# Altium project ADAS_ECU_revA.PrjPcb (part 6 of 6)
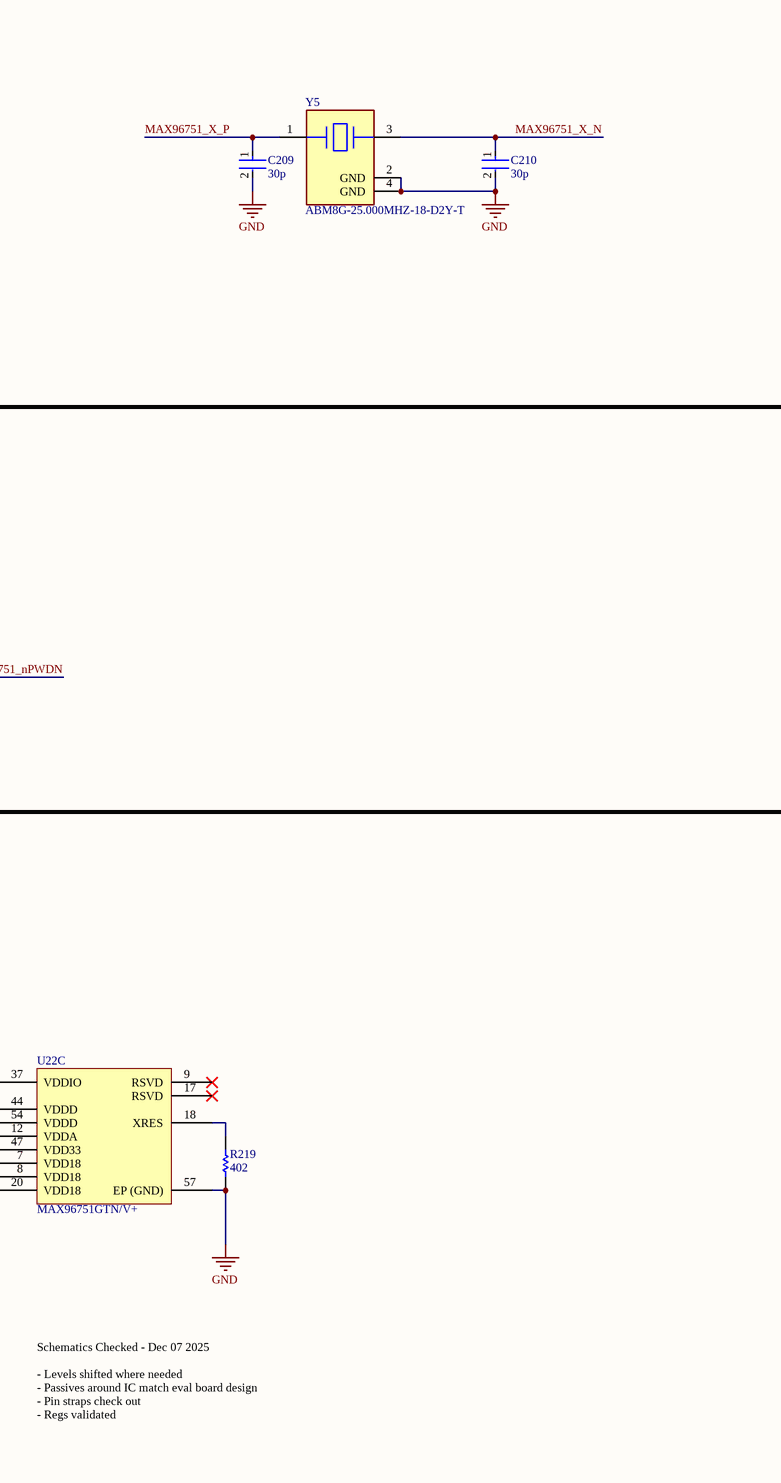
[diagram p45: MAX96751_PINOUT.SchDoc, bottom right]

## Nets that join several sheets
3V3_HDMI: ADAS_ECU_revA (F19.2), DP_TO_HDMI (U28.5)
3V3_INT: ADAS_ECU_revA (5 pins), JETSON_V2 (R232.2 R234.2 R238.2 R240.2), STM32G473RET6_PINOUT (19 pins), TCAN1146_PINOUT (C125.1 U9.5), OR_0 (R58_OR_0.2), OR_1 (R58_OR_1.2), PWR_PROT_0 (C74_PWR_PROT_0.1 R66_PWR_PROT_0.2 U7_PWR_PROT_0.12), LM704A0_5V0_PINOUT (R17.1 R85.2), INT_REG (C63.1 R50.1 U11.2 U11.4), PWR_PROT_1 (C74_PWR_PROT_1.1 R66_PWR_PROT_1.2 U7_PWR_PROT_1.12), PWR_PROT_2 (C74_PWR_PROT_2.1 R66_PWR_PROT_2.2 U7_PWR_PROT_2.12), LM704A0_3V3_PINOUT (R?#16.2 R?#18.1), LM5177_PINOUT (R110.1 R116.2), JETSON_PWR_MUX (R128.1), FUSE_AND_VI_SENSE (C155.1 R131.2 U14.12), DES_0 (6 pins), DES_1 (6 pins)
3V3_M2_NVME: ADAS_ECU_revA (F14.2), M2_NVME (19 pins)
3V3_M2_WIFI: ADAS_ECU_revA (F15.2), JETSON_V2 (R242.2 R244.2), M2_WIFI (14 pins)
3V3_MAIN: ADAS_ECU_revA (9 pins), RAIL_DISCH_2 (R?_RAIL_DISCH_2#1.1), LM704A0_3V3_PINOUT (9 pins)
3V3_SER_0: ADAS_ECU_revA (F18.2), MAX96751_PINOUT (19 pins)
5V0_HDMI: ADAS_ECU_revA (F11.2), DP_TO_HDMI (U29.5)
5V0_INT: TCAN1146_PINOUT (C124.1 U9.3), INT_REG (C61.1 R48.1 U10.2 U10.4)
5V0_JETSON: ADAS_ECU_revA (F10.2 U15.5 U16.5), JETSON_PWR_MUX (Q17.5-6-7-8)
5V0_MAIN: ADAS_ECU_revA (9 pins), RAIL_DISCH_1 (R?_RAIL_DISCH_1#1.1), LM704A0_5V0_PINOUT (13 pins)
12V0_JETSON: ADAS_ECU_revA (F9.2), JETSON_PWR_MUX (Q15.5-6-7-8)
12V0_MAIN: ADAS_ECU_revA (F6.1 F7.1 F8.1 F9.1), RAIL_DISCH_0 (R?_RAIL_DISCH_0#1.1), LM5177_PINOUT (11 pins)
12V0_PoC_0: ADAS_ECU_revA (F6.2), DES_0 (F1_DES_0.1 F2_DES_0.1 F3_DES_0.1 F4_DES_0.1)
12V0_PoC_1: ADAS_ECU_revA (F7.2), DES_1 (F1_DES_1.1 F2_DES_1.1 F3_DES_1.1 F4_DES_1.1)
APM_VCC: ADAS_ECU_revA (6 pins), OR_1 (6 pins)
CAR_VCC: ADAS_ECU_revA (6 pins), OR_0 (6 pins)
GND: ADAS_ECU_revA (192 pins), JETSON_V2 (83 pins), M2_NVME (30 pins), RAIL_DISCH_0 (5 pins), RAIL_DISCH_1 (5 pins), RAIL_DISCH_2 (5 pins), M2_WIFI (29 pins), STM32G473RET6_PINOUT (28 pins), TCAN1146_PINOUT (10 pins), OR_0 (19 pins), OR_1 (19 pins), PWR_PROT_0 (C74_PWR_PROT_0.2 U7_PWR_PROT_0.5), LM704A0_5V0_PINOUT (30 pins), INT_REG (9 pins), PWR_PROT_1 (C74_PWR_PROT_1.2 U7_PWR_PROT_1.5), PWR_PROT_2 (C74_PWR_PROT_2.2 U7_PWR_PROT_2.5), ADC_1 (5 pins), LM704A0_3V3_PINOUT (27 pins), LM5177_PINOUT (38 pins), ADC_0 (5 pins), ADC_2 (5 pins), JETSON_PWR_MUX (5 pins), FUSE_AND_VI_SENSE (6 pins), DES_0 (61 pins), DP_TO_HDMI (19 pins), DES_1 (61 pins), MAX96751_PINOUT (30 pins)
INT_VCC: PWR_PROT_0 (F5_PWR_PROT_0.1), INT_REG (C60.1 C62.1 U10.3 U11.3), PWR_PROT_1 (F5_PWR_PROT_1.1), PWR_PROT_2 (F5_PWR_PROT_2.1), FUSE_AND_VI_SENSE (R134.2 U14.3 U14.4)
JETSON_VCC: JETSON_V2 (17 pins), JETSON_PWR_MUX (Q16.5-6-7-8 Q18.5-6-7-8 R124.2)
JSN_1V8_REF: ADAS_ECU_revA (9 pins), JETSON_V2 (14 pins), M2_WIFI (C190.1 U21.5), DES_0 (Q4_DES_0.1 R24_DES_0.2), DP_TO_HDMI (8 pins), DES_1 (Q4_DES_1.1 R24_DES_1.2), MAX96751_PINOUT (Q31.1 R217.2)
MAX96724_3V3: ADAS_ECU_revA (F16.2), DES_0 (11 pins)
MAX96724_3V3: ADAS_ECU_revA (F17.2), DES_1 (11 pins)
PRE_VCC: ADAS_ECU_revA (R148.2), RAIL_DISCH_0 (R?_RAIL_DISCH_0#2.2), RAIL_DISCH_1 (R?_RAIL_DISCH_1#2.2), RAIL_DISCH_2 (R?_RAIL_DISCH_2#2.2), STM32G473RET6_PINOUT (Q?.2 R?#5.2), TCAN1146_PINOUT (D7.2), OR_0 (5 pins), OR_1 (5 pins), FUSE_AND_VI_SENSE (7 pins)
1V8_BT_M2_EN (GPIO03): JETSON_V2 (J135.126), M2_WIFI (R200.2)
1V8_BT_M2_WAKE_AP (GPIO02): JETSON_V2 (J135.124 R243.1 R244.1), M2_WIFI (R192.2)
1V8_CAM0_PWDN: JETSON_V2 (J135.114), DES_0 (Q4_DES_0.2 R24_DES_0.1)
1V8_CAM1_PWDN: JETSON_V2 (J135.120), DES_1 (Q4_DES_1.2 R24_DES_1.1)
1V8_CPU_FAN_PWM: ADAS_ECU_revA (R178.2), JETSON_V2 (J135.230)
1V8_CPU_FAN_TACH: ADAS_ECU_revA (R172.2), JETSON_V2 (J135.208)
1V8_DP1_AUX_N: JETSON_V2 (J135.98), DP_TO_HDMI (Q34.2 R251.1)
1V8_DP1_AUX_P: JETSON_V2 (J135.100), DP_TO_HDMI (Q36.2 R256.1)
1V8_DP1_HPD: JETSON_V2 (J135.96), DP_TO_HDMI (Q38.3 R266.1 U30.4)
1V8_GPIO01: ADAS_ECU_revA (TP3.1), JETSON_V2 (J135.118)
1V8_GPIO04: ADAS_ECU_revA (TP4.1), JETSON_V2 (J135.127)
1V8_GPIO06: ADAS_ECU_revA (TP5.1), JETSON_V2 (J135.130)
1V8_GPIO07_PWM: ADAS_ECU_revA (R173.2), JETSON_V2 (J135.206)
1V8_GPIO09: ADAS_ECU_revA (TP6.1), JETSON_V2 (J135.211)
1V8_GPIO11: ADAS_ECU_revA (TP7.1), JETSON_V2 (J135.216)
1V8_GPIO12: ADAS_ECU_revA (TP8.1), JETSON_V2 (J135.218)
1V8_GPIO13_PWM: ADAS_ECU_revA (R179.2), JETSON_V2 (J135.228)
1V8_I2C2_SCL: JETSON_V2 (J135.232 R236.1), M2_NVME (R185.2), M2_WIFI (R195.2)
1V8_I2C2_SDA: JETSON_V2 (J135.234 R230.1), M2_NVME (R186.2), M2_WIFI (R193.2)
1V8_I2S0_DOUT: JETSON_V2 (J135.193), MAX96751_PINOUT (U22.41)
1V8_I2S0_FS: JETSON_V2 (J135.197), MAX96751_PINOUT (U22.39)
1V8_I2S0_SCLK: JETSON_V2 (J135.199), MAX96751_PINOUT (U22.40)
1V8_I2S1_DIN: JETSON_V2 (J135.222), M2_WIFI (J14.12)
1V8_I2S1_DOUT: JETSON_V2 (J135.220), M2_WIFI (J14.14)
1V8_I2S1_FS: JETSON_V2 (J135.224), M2_WIFI (J14.10)
1V8_I2S1_SCLK: JETSON_V2 (J135.226), M2_WIFI (J14.8)
1V8_nM2_ALERT: ADAS_ECU_revA (U20.4), JETSON_V2 (J135.212)
1V8_nMOD_SLEEP: JETSON_V2 (J135.178), DP_TO_HDMI (R262.1 R263.2 U28.4)
1V8_nSYS_RESET: ADAS_ECU_revA (R143.1 R144.2 U17.4), JETSON_V2 (J135.239)
1V8_UART0_CTS: JETSON_V2 (J135.105), M2_WIFI (J14.34)
1V8_UART0_RTS: JETSON_V2 (J135.103), M2_WIFI (J14.36)
1V8_UART0_RXD: JETSON_V2 (J135.101), M2_WIFI (J14.22)
1V8_UART0_TXD: JETSON_V2 (J135.99), M2_WIFI (J14.32)
1V8_W_DISABLE1_CTRL (GPIO05): JETSON_V2 (J135.128), M2_WIFI (R197.2)
3V3_3V3_MAIN_ENABLE: RAIL_DISCH_2 (R?_RAIL_DISCH_2#4.2), LM704A0_3V3_PINOUT (R?#13.2)
3V3_5V0_MAIN_ENABLE: RAIL_DISCH_1 (R?_RAIL_DISCH_1#4.2), LM704A0_5V0_PINOUT (R83.2)
3V3_12V0_MAIN_ENABLE: RAIL_DISCH_0 (R?_RAIL_DISCH_0#4.2), LM5177_PINOUT (R114.2)
3V3_CAMI2C_SCL: JETSON_V2 (J135.213 R227.1), DES_0 (U1_DES_0.29), DES_1 (U1_DES_1.29)
3V3_CAMI2C_SDA: JETSON_V2 (J135.215 R223.1), DES_0 (U1_DES_0.28), DES_1 (U1_DES_1.28)
3V3_CAN_RX: JETSON_V2 (J135.143), TCAN1146_PINOUT (U9.4)
3V3_CAN_TX: JETSON_V2 (J135.145), TCAN1146_PINOUT (U9.1)
3V3_DP1_CEC: JETSON_V2 (J135.94), DP_TO_HDMI (D31.1 Q37.2 R258.2)
3V3_I2C0_SCL: JETSON_V2 (J135.185 R226.1), MAX96751_PINOUT (U22.11)
3V3_I2C0_SDA: JETSON_V2 (J135.187 R222.1), MAX96751_PINOUT (U22.10)
3V3_I2C1_SCL: ADAS_ECU_revA (TP2.1), JETSON_V2 (J135.189 R235.1)
3V3_I2C1_SDA: ADAS_ECU_revA (TP1.1), JETSON_V2 (J135.191 R229.1)
3V3_MAIN_PWR_IN: PWR_PROT_2 (U7_PWR_PROT_2.3 U7_PWR_PROT_2.4), LM704A0_3V3_PINOUT (11 pins)
3V3_MAX96724_I_SNS_SCL: DES_0 (U4_DES_0.4), DES_1 (U4_DES_1.4)
3V3_MAX96724_I_SNS_SDA: DES_0 (U4_DES_0.5), DES_1 (U4_DES_1.5)
3V3_MODULE_ID: ADAS_ECU_revA (U18.2), JETSON_V2 (J135.217), JETSON_PWR_MUX (R129.1)
3V3_PCIE0_CLKREQ: JETSON_V2 (J135.180), M2_NVME (J13.52)
3V3_PCIE0_nRST: JETSON_V2 (J135.181), M2_NVME (J13.50)
3V3_PCIE0_nWAKE: JETSON_V2 (J135.179), M2_NVME (J13.54), M2_WIFI (J14.55)
3V3_PCIE1_CLKREQ: JETSON_V2 (J135.182), M2_WIFI (J14.53)
3V3_PCIE1_nRST: JETSON_V2 (J135.183), M2_WIFI (J14.52)
3V3_UART2_RXD: ADAS_ECU_revA (J7.4), JETSON_V2 (Q33.3 R240.1)
3V3_UART2_TXD: ADAS_ECU_revA (J7.3), JETSON_V2 (Q33.6 R234.1)
5V0_MAIN_PWR_IN: LM704A0_5V0_PINOUT (10 pins), PWR_PROT_1 (U7_PWR_PROT_1.3 U7_PWR_PROT_1.4)
5V0_nSHDN_REQ: ADAS_ECU_revA (D14.1), JETSON_V2 (J135.233)
5V0_POWER_EN: ADAS_ECU_revA (R138.2 U15.1), JETSON_V2 (J135.237)
5V0_SLEEP/nWAKE: ADAS_ECU_revA (R140.2 U16.1), JETSON_V2 (J135.240)
12V0_MAIN_PWR_IN: PWR_PROT_0 (U7_PWR_PROT_0.3 U7_PWR_PROT_0.4), LM5177_PINOUT (10 pins)
CAN_N: ADAS_ECU_revA (J3.23), TCAN1146_PINOUT (C128.1 D8.2 L15.4 R103.2)
CAN_P: ADAS_ECU_revA (J3.22), TCAN1146_PINOUT (C130.2 D8.1 L15.1 R104.1)
CSI0_CLK_N: JETSON_V2 (J135.10), DES_0 (U1_DES_0.40)
CSI0_CLK_P: JETSON_V2 (J135.12), DES_0 (U1_DES_0.39)
CSI0_D0_N: JETSON_V2 (J135.4), DES_0 (U1_DES_0.32)
CSI0_D0_P: JETSON_V2 (J135.6), DES_0 (U1_DES_0.31)
CSI0_D1_N: JETSON_V2 (J135.16), DES_0 (U1_DES_0.35)
CSI0_D1_P: JETSON_V2 (J135.18), DES_0 (U1_DES_0.36)
CSI1_D0_N: JETSON_V2 (J135.3), DES_0 (U1_DES_0.37)
CSI1_D0_P: JETSON_V2 (J135.5), DES_0 (U1_DES_0.38)
CSI1_D1_N: JETSON_V2 (J135.15), DES_0 (U1_DES_0.42)
CSI1_D1_P: JETSON_V2 (J135.17), DES_0 (U1_DES_0.41)
CSI2_CLK_N: JETSON_V2 (J135.28), DES_1 (U1_DES_1.40)
CSI2_CLK_P: JETSON_V2 (J135.30), DES_1 (U1_DES_1.39)
CSI2_D0_N: JETSON_V2 (J135.22), DES_1 (U1_DES_1.32)
CSI2_D0_P: JETSON_V2 (J135.24), DES_1 (U1_DES_1.31)
CSI2_D1_N: JETSON_V2 (J135.34), DES_1 (U1_DES_1.36)
CSI2_D1_P: JETSON_V2 (J135.36), DES_1 (U1_DES_1.35)
CSI3_D0_N: JETSON_V2 (J135.21), DES_1 (U1_DES_1.38)
CSI3_D0_P: JETSON_V2 (J135.23), DES_1 (U1_DES_1.37)
CSI3_D1_N: JETSON_V2 (J135.33), DES_1 (U1_DES_1.42)
CSI3_D1_P: JETSON_V2 (J135.35), DES_1 (U1_DES_1.41)
DP1_TXD0_N: JETSON_V2 (J135.63), DP_TO_HDMI (C242.2)
DP1_TXD0_P: JETSON_V2 (J135.65), DP_TO_HDMI (C241.2)
DP1_TXD1_N: JETSON_V2 (J135.69), DP_TO_HDMI (C244.2)
DP1_TXD1_P: JETSON_V2 (J135.71), DP_TO_HDMI (C243.2)
DP1_TXD2_N: JETSON_V2 (J135.75), DP_TO_HDMI (C246.2)
DP1_TXD2_P: JETSON_V2 (J135.77), DP_TO_HDMI (C245.2)
DP1_TXD3_N: JETSON_V2 (J135.81), DP_TO_HDMI (C248.2)
DP1_TXD3_P: JETSON_V2 (J135.83), DP_TO_HDMI (C247.2)
ETH_MDI0_N: ADAS_ECU_revA (D27.2 J10.P2), JETSON_V2 (J135.184)
ETH_MDI0_P: ADAS_ECU_revA (D27.1 J10.P1), JETSON_V2 (J135.186)
ETH_MDI1_N: ADAS_ECU_revA (D27.5 J10.P4), JETSON_V2 (J135.190)
ETH_MDI1_P: ADAS_ECU_revA (D27.4 J10.P3), JETSON_V2 (J135.192)
ETH_MDI2_N: ADAS_ECU_revA (D28.2 J10.P8), JETSON_V2 (J135.196)
ETH_MDI2_P: ADAS_ECU_revA (D28.1 J10.P7), JETSON_V2 (J135.198)
ETH_MDI3_N: ADAS_ECU_revA (D28.5 J10.P10), JETSON_V2 (J135.202)
ETH_MDI3_P: ADAS_ECU_revA (D28.4 J10.P9), JETSON_V2 (J135.204)
HDMI_5V: ADAS_ECU_revA (D21.2 D21.9 J5.18 R279.1), DP_TO_HDMI (5 pins)
HDMI_CEC: ADAS_ECU_revA (J5.13), DP_TO_HDMI (C251.1 R259.2 R260.2)
HDMI_CLK_N: ADAS_ECU_revA (R158.1 R276.1), DP_TO_HDMI (C248.1 R247.2)
HDMI_CLK_P: ADAS_ECU_revA (R157.1 R275.1), DP_TO_HDMI (C247.1 R246.2)
HDMI_D0_N: ADAS_ECU_revA (R156.1 R270.1), DP_TO_HDMI (C246.1 R245.2)
HDMI_D0_P: ADAS_ECU_revA (R155.1 R269.1), DP_TO_HDMI (C245.1 R163.2)
HDMI_D1_N: ADAS_ECU_revA (R154.1 R272.1), DP_TO_HDMI (C244.1 R162.2)
HDMI_D1_P: ADAS_ECU_revA (R153.1 R271.1), DP_TO_HDMI (C243.1 R161.2)
HDMI_D2_N: ADAS_ECU_revA (R152.1 R274.1), DP_TO_HDMI (C242.1 R160.2)
HDMI_D2_P: ADAS_ECU_revA (R151.1 R273.1), DP_TO_HDMI (C241.1 R159.2)
HDMI_HP_DET: ADAS_ECU_revA (D21.1 D21.10 J5.19 R280.1), DP_TO_HDMI (C253.1 R265.1)
HDMI_SCL: ADAS_ECU_revA (D21.5 D21.6 J5.15 R278.1), DP_TO_HDMI (C250.1 Q36.3 R257.1)
HDMI_SDA: ADAS_ECU_revA (D21.4 D21.7 J5.16 R277.1), DP_TO_HDMI (C249.1 Q34.3 R252.1)
HV_PWR_EN: TCAN1146_PINOUT (U9.7), OR_0 (U12_OR_0.7), OR_1 (U12_OR_1.7), FUSE_AND_VI_SENSE (R135.1)
MAX96724_PoC_A: ADAS_ECU_revA (J1.2), DES_0 (C1_DES_0.2 L3_DES_0.2)
MAX96724_PoC_A: ADAS_ECU_revA (J4.2), DES_1 (C1_DES_1.2 L3_DES_1.2)
MAX96724_PoC_B: ADAS_ECU_revA (J1.1), DES_0 (C9_DES_0.2 L6_DES_0.2)
MAX96724_PoC_B: ADAS_ECU_revA (J4.1), DES_1 (C9_DES_1.2 L6_DES_1.2)
MAX96724_PoC_C: ADAS_ECU_revA (J1.4), DES_0 (C19_DES_0.2 L9_DES_0.2)
MAX96724_PoC_C: ADAS_ECU_revA (J4.4), DES_1 (C19_DES_1.2 L9_DES_1.2)
MAX96724_PoC_D: ADAS_ECU_revA (J1.3), DES_0 (C25_DES_0.2 L12_DES_0.2)
MAX96724_PoC_D: ADAS_ECU_revA (J4.3), DES_1 (C25_DES_1.2 L12_DES_1.2)
MAX96751_CLK_N: ADAS_ECU_revA (R276.2), MAX96751_PINOUT (U22.45)
MAX96751_CLK_P: ADAS_ECU_revA (R275.2), MAX96751_PINOUT (U22.46)
MAX96751_RX0_N: ADAS_ECU_revA (R270.2), MAX96751_PINOUT (U22.48)
MAX96751_RX0_P: ADAS_ECU_revA (R269.2), MAX96751_PINOUT (U22.49)
MAX96751_RX1_N: ADAS_ECU_revA (R272.2), MAX96751_PINOUT (U22.50)
MAX96751_RX1_P: ADAS_ECU_revA (R271.2), MAX96751_PINOUT (U22.51)
MAX96751_RX2_N: ADAS_ECU_revA (R274.2), MAX96751_PINOUT (U22.52)
MAX96751_RX2_P: ADAS_ECU_revA (R273.2), MAX96751_PINOUT (U22.53)
NetJ14_50: JETSON_V2 (R242.1 U27.4), M2_WIFI (J14.50)
NetQ30_3: ADAS_ECU_revA (R278.2), MAX96751_PINOUT (Q30.3 R215.1)
NetQ30_6: ADAS_ECU_revA (R277.2), MAX96751_PINOUT (Q30.6 R213.1)
NetR207_2: ADAS_ECU_revA (R280.2), MAX96751_PINOUT (R207.2)
NetR209_2: ADAS_ECU_revA (R279.2), MAX96751_PINOUT (R209.2)
nNVME_M2_ALERT: ADAS_ECU_revA (R184.2), M2_NVME (R187.2)
nWIFI_M2_ALERT: ADAS_ECU_revA (R183.2), M2_WIFI (R196.2)
OD_ETH_LED_ACT: ADAS_ECU_revA (J10.P13), JETSON_V2 (J135.194)
OD_ETH_LED_LINK: ADAS_ECU_revA (J10.P12), JETSON_V2 (J135.188)
PCIE0_CLK_N: JETSON_V2 (J135.160), M2_NVME (J13.53)
PCIE0_CLK_P: JETSON_V2 (J135.162), M2_NVME (J13.55)
PCIE0_RX0_N: JETSON_V2 (J135.131), M2_NVME (J13.5)
PCIE0_RX0_P: JETSON_V2 (J135.133), M2_NVME (J13.7)
PCIE0_RX1_N: JETSON_V2 (J135.137), M2_NVME (J13.17)
PCIE0_RX1_P: JETSON_V2 (J135.139), M2_NVME (J13.19)
PCIE0_RX2_N: JETSON_V2 (J135.149), M2_NVME (J13.29)
PCIE0_RX2_P: JETSON_V2 (J135.151), M2_NVME (J13.31)
PCIE0_RX3_N: JETSON_V2 (J135.155), M2_NVME (J13.41)
PCIE0_RX3_P: JETSON_V2 (J135.157), M2_NVME (J13.43)
PCIE0_TX0_N: JETSON_V2 (J135.134), M2_NVME (C170.1)
PCIE0_TX0_P: JETSON_V2 (J135.136), M2_NVME (C171.1)
PCIE0_TX1_N: JETSON_V2 (J135.140), M2_NVME (C175.1)
PCIE0_TX1_P: JETSON_V2 (J135.142), M2_NVME (C176.1)
PCIE0_TX2_N: JETSON_V2 (J135.148), M2_NVME (C177.1)
PCIE0_TX2_P: JETSON_V2 (J135.150), M2_NVME (C178.1)
PCIE0_TX3_N: JETSON_V2 (J135.154), M2_NVME (C179.1)
PCIE0_TX3_P: JETSON_V2 (J135.156), M2_NVME (C180.1)
PCIE1_CLK_N: JETSON_V2 (J135.173), M2_WIFI (J14.47)
PCIE1_CLK_P: JETSON_V2 (J135.175), M2_WIFI (J14.49)
PCIE1_RX0_N: JETSON_V2 (J135.167), M2_WIFI (J14.41)
PCIE1_RX0_P: JETSON_V2 (J135.169), M2_WIFI (J14.43)
PCIE1_TX0_N: JETSON_V2 (J135.172), M2_WIFI (C192.1)
PCIE1_TX0_P: JETSON_V2 (J135.174), M2_WIFI (C191.1)
RF_MAX96751_0_A_N: ADAS_ECU_revA (J8.3), MAX96751_PINOUT (C204.2 R205.1)
RF_MAX96751_0_A_P: ADAS_ECU_revA (J8.1), MAX96751_PINOUT (C201.2 R204.1)
RF_MAX96751_0_B_N: ADAS_ECU_revA (J8.2), MAX96751_PINOUT (C208.2 R208.1)
RF_MAX96751_0_B_P: ADAS_ECU_revA (J8.4), MAX96751_PINOUT (C207.2 R206.1)
USB2_0_N: ADAS_ECU_revA (D23.2 J6.2), JETSON_V2 (J135.109)
USB2_0_P: ADAS_ECU_revA (D23.1 J6.3), JETSON_V2 (J135.111)
USB2_1_N: ADAS_ECU_revA (D29.2), JETSON_V2 (J135.115)
USB2_1_P: ADAS_ECU_revA (D29.4), JETSON_V2 (J135.117)
USB2_2_N: JETSON_V2 (J135.121), M2_WIFI (J14.5)
USB2_2_P: JETSON_V2 (J135.123), M2_WIFI (J14.3)